# EAGLE design BRD1001-001-004-320 - Register (EAGLE 9.4.2)
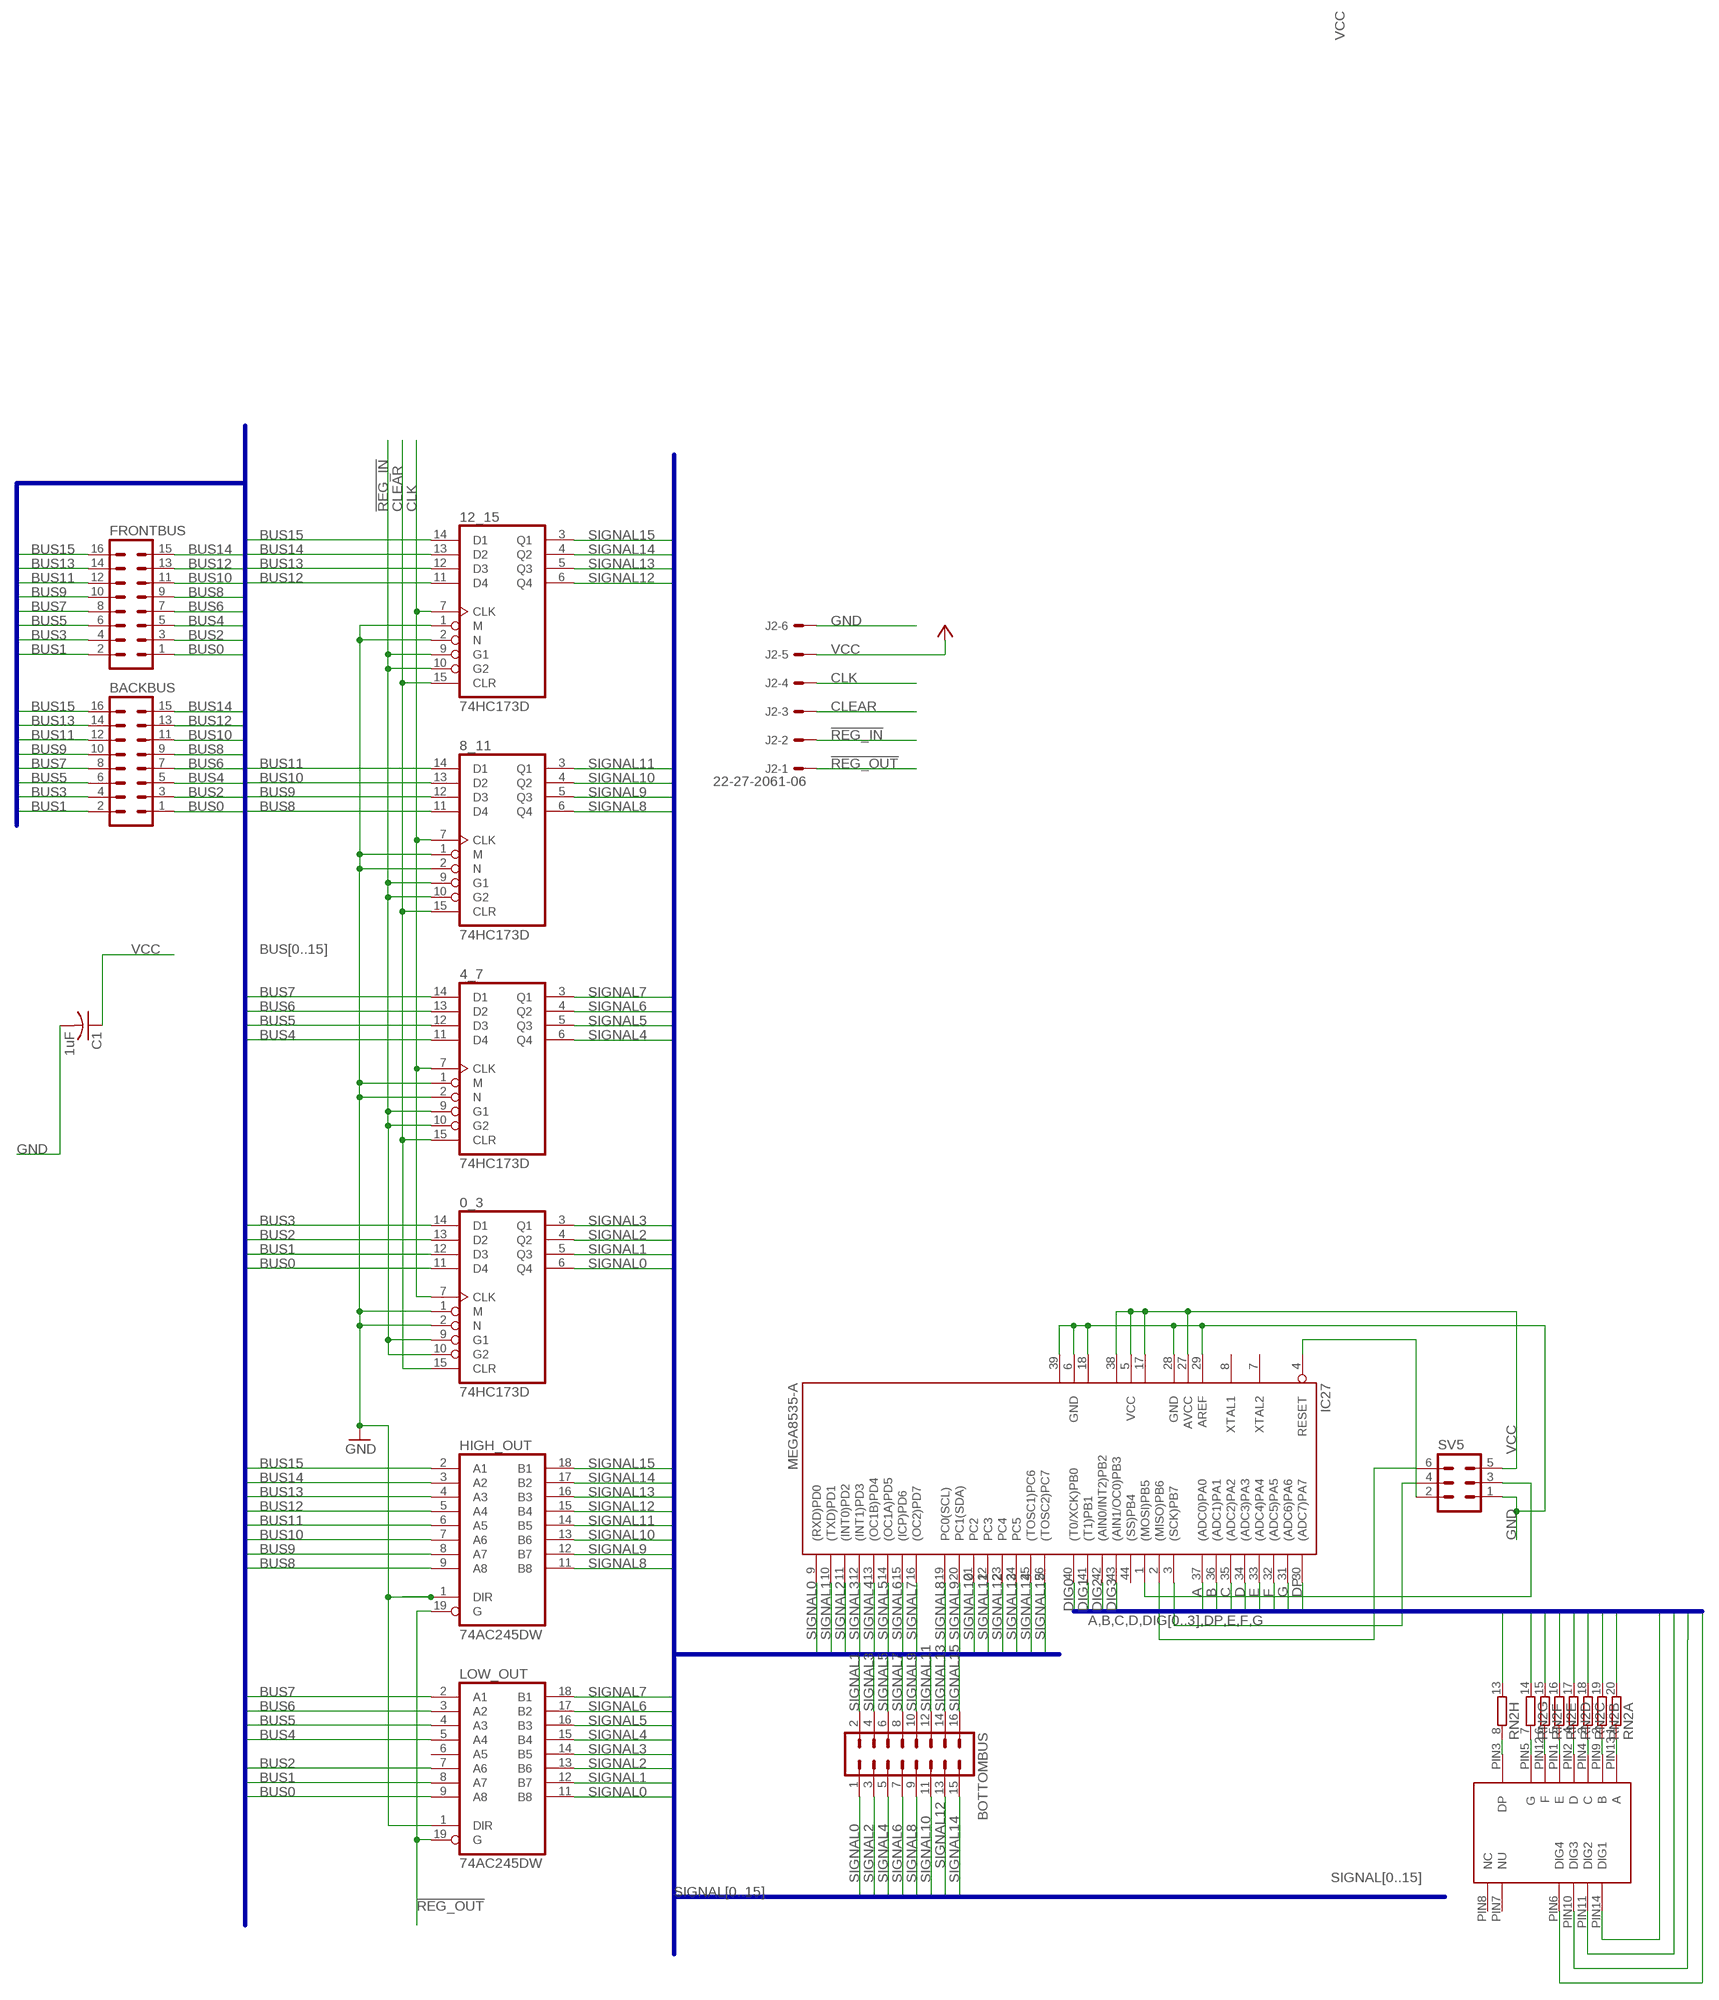
[diagram p0: schematic, sheet 1]

## Parts
0_3  74HC173D  [SO16]
4_7  74HC173D  [SO16]
8_11  74HC173D  [SO16]
12_15  74HC173D  [SO16]
BACKBUS  ML16  [ML16]
BOTTOMBUS  ML16  [ML16]
C1  1uF  C-USC1206  [C1206]
FRONTBUS  ML16  [ML16]
HIGH_OUT  74AC245DW  [SO20W]
IC27  MEGA8535-A  [TQFP44]
J2  22-27-2061-06  [6410-06]
LOW_OUT  74AC245DW  [SO20W]
RN2  10R-NSOMC  [SOMC20]
SV5  ML6  [ML6]
U$1  4-DIGIT-7-SEGMENT  [4-DIGIT-7-SEGMENT]

## Nets
!REG_IN: 0_3.9(G1) 0_3.10(G2) 4_7.9(G1) 4_7.10(G2) 8_11.9(G1) 8_11.10(G2) 12_15.9(G1) 12_15.10(G2) J2.2
!REG_OUT: HIGH_OUT.19(G) J2.1 LOW_OUT.19(G)
A: IC27.37((ADC0)PA0) RN2.20
B: IC27.36((ADC1)PA1) RN2.19
BUS0: 0_3.11(D4) BACKBUS.1 FRONTBUS.1 LOW_OUT.9(A8)
BUS1: 0_3.12(D3) BACKBUS.2 FRONTBUS.2 LOW_OUT.8(A7)
BUS2: 0_3.13(D2) BACKBUS.3 FRONTBUS.3 LOW_OUT.7(A6)
BUS3: 0_3.14(D1) BACKBUS.4 FRONTBUS.4
BUS4: 4_7.11(D4) BACKBUS.5 FRONTBUS.5 LOW_OUT.5(A4)
BUS5: 4_7.12(D3) BACKBUS.6 FRONTBUS.6 LOW_OUT.4(A3)
BUS6: 4_7.13(D2) BACKBUS.7 FRONTBUS.7 LOW_OUT.3(A2)
BUS7: 4_7.14(D1) BACKBUS.8 FRONTBUS.8 LOW_OUT.2(A1)
BUS8: 8_11.11(D4) BACKBUS.9 FRONTBUS.9 HIGH_OUT.9(A8)
BUS9: 8_11.12(D3) BACKBUS.10 FRONTBUS.10 HIGH_OUT.8(A7)
BUS10: 8_11.13(D2) BACKBUS.11 FRONTBUS.11 HIGH_OUT.7(A6)
BUS11: 8_11.14(D1) BACKBUS.12 FRONTBUS.12 HIGH_OUT.6(A5)
BUS12: 12_15.11(D4) BACKBUS.13 FRONTBUS.13 HIGH_OUT.5(A4)
BUS13: 12_15.12(D3) BACKBUS.14 FRONTBUS.14 HIGH_OUT.4(A3)
BUS14: 12_15.13(D2) BACKBUS.15 FRONTBUS.15 HIGH_OUT.3(A2)
BUS15: 12_15.14(D1) BACKBUS.16 FRONTBUS.16 HIGH_OUT.2(A1)
C: IC27.35((ADC2)PA2) RN2.18
CLEAR: 0_3.15(CLR) 4_7.15(CLR) 8_11.15(CLR) 12_15.15(CLR) J2.3
CLK: 0_3.7(CLK) 4_7.7(CLK) 8_11.7(CLK) 12_15.7(CLK) J2.4
D: IC27.34((ADC3)PA3) RN2.17
DIG0: IC27.40((T0/XCK)PB0) U$1.PIN14(DIG1)
DIG1: IC27.41((T1)PB1) U$1.PIN11(DIG2)
DIG2: IC27.42((AIN0/INT2)PB2) U$1.PIN10(DIG3)
DIG3: IC27.43((AIN1/OC0)PB3) U$1.PIN6(DIG4)
DP: IC27.30((ADC7)PA7) RN2.13
E: IC27.33((ADC4)PA4) RN2.16
F: IC27.32((ADC5)PA5) RN2.15
G: IC27.31((ADC6)PA6) RN2.14
GND [power]: 0_3.1(M) 0_3.2(N) 4_7.1(M) 4_7.2(N) 8_11.1(M) 8_11.2(N) 12_15.1(M) 12_15.2(N) C1.2 HIGH_OUT.1(DIR) IC27.6(GND) IC27.18(GND1) IC27.28(GND) IC27.29(AREF) IC27.39(GND2) J2.6 LOW_OUT.1(DIR) SV5.1
N$18: IC27.1((MOSI)PB5) SV5.3
N$19: IC27.3((SCK)PB7) SV5.4
N$20: IC27.2((MISO)PB6) SV5.6
N$21: IC27.4(RESET) SV5.2
N$24: RN2.1 U$1.PIN13(A)
N$25: RN2.2 U$1.PIN9(B)
N$26: RN2.3 U$1.PIN4(C)
N$27: RN2.4 U$1.PIN2(D)
N$28: RN2.5 U$1.PIN1(E)
N$29: RN2.6 U$1.PIN12(F)
N$30: RN2.7 U$1.PIN5(G)
N$31: RN2.8 U$1.PIN3(DP)
SIGNAL0: 0_3.6(Q4) BOTTOMBUS.1 IC27.9((RXD)PD0) LOW_OUT.11(B8)
SIGNAL1: 0_3.5(Q3) BOTTOMBUS.2 IC27.10((TXD)PD1) LOW_OUT.12(B7)
SIGNAL2: 0_3.4(Q2) BOTTOMBUS.3 IC27.11((INT0)PD2) LOW_OUT.13(B6)
SIGNAL3: 0_3.3(Q1) BOTTOMBUS.4 IC27.12((INT1)PD3) LOW_OUT.14(B5)
SIGNAL4: 4_7.6(Q4) BOTTOMBUS.5 IC27.13((OC1B)PD4) LOW_OUT.15(B4)
SIGNAL5: 4_7.5(Q3) BOTTOMBUS.6 IC27.14((OC1A)PD5) LOW_OUT.16(B3)
SIGNAL6: 4_7.4(Q2) BOTTOMBUS.7 IC27.15((ICP)PD6) LOW_OUT.17(B2)
SIGNAL7: 4_7.3(Q1) BOTTOMBUS.8 IC27.16((OC2)PD7) LOW_OUT.18(B1)
SIGNAL8: 8_11.6(Q4) BOTTOMBUS.9 HIGH_OUT.11(B8) IC27.19(PC0(SCL))
SIGNAL9: 8_11.5(Q3) BOTTOMBUS.10 HIGH_OUT.12(B7) IC27.20(PC1(SDA))
SIGNAL10: 8_11.4(Q2) BOTTOMBUS.11 HIGH_OUT.13(B6) IC27.21(PC2)
SIGNAL11: 8_11.3(Q1) BOTTOMBUS.12 HIGH_OUT.14(B5) IC27.22(PC3)
SIGNAL12: 12_15.6(Q4) BOTTOMBUS.13 HIGH_OUT.15(B4) IC27.23(PC4)
SIGNAL13: 12_15.5(Q3) BOTTOMBUS.14 HIGH_OUT.16(B3) IC27.24(PC5)
SIGNAL14: 12_15.4(Q2) BOTTOMBUS.15 HIGH_OUT.17(B2) IC27.25((TOSC1)PC6)
SIGNAL15: 12_15.3(Q1) BOTTOMBUS.16 HIGH_OUT.18(B1) IC27.26((TOSC2)PC7)
VCC [power]: C1.1 IC27.5(VCC) IC27.17(VCC1) IC27.27(AVCC) IC27.38(VCC2) J2.5 SV5.5
Unconnected: IC27.7(XTAL2) IC27.8(XTAL1) IC27.44((SS)PB4) LOW_OUT.6(A5) RN2.9 RN2.10 RN2.11 RN2.12 U$1.PIN7(NU) U$1.PIN8(NC)

## Buses
BUS[0..15]
SIGNAL[0..15]
A,B,C,D,DIG[0..3],DP,E,F,G

## Power pins joined to a net without a drawn wire
GND: 0_3.8(GND) 4_7.8(GND) 8_11.8(GND) 12_15.8(GND) HIGH_OUT.10(GND) LOW_OUT.10(GND)
VCC: 0_3.16(VCC) 4_7.16(VCC) 8_11.16(VCC) 12_15.16(VCC) HIGH_OUT.20(VCC) LOW_OUT.20(VCC)

## Library data of the parts
0_3 4_7 8_11 12_15 = 74xx-eu:74*173: 4-bit D type REGISTER, 3-state
BACKBUS BOTTOMBUS FRONTBUS = con-harting-ml:ML16: HARTING; OC_FARNELL: unknown; OC_NEWARK: unknown
C1 = rcl:C-US: CAPACITOR, American symbol; SPICEPREFIX: C
HIGH_OUT LOW_OUT = 74xx-eu:74*245: Octal BUS TRANSCEIVER, 3-state
IC27 = atmel:MEGA8535: MICROCONTROLLER 8 Kbytes FLASH 512 bytes SRAM 512 bytes EEPROM USART 8-channel 10 bit ADC Source: avr.lbr; MPN: ATMEGA8535-16AU; OC_FARNELL: 1528437; OC_NEWARK: 01M6908
J2 = con-molex:22-?-06: CONNECTOR wire to board 2.54 mm (.1 inch) pitch header; MF: MOLEX; OC_FARNELL: unknown; OC_NEWARK: unknown
RN2 = resistor-dil:10R-N: DIL RESISTOR; OC_FARNELL: unknown; OC_NEWARK: unknown
SV5 = con-harting-ml:ML6: HARTING; OC_FARNELL: unknown; OC_NEWARK: unknown
U$1 = ADAFRUIT:4-DIGIT-7-SEGMENT

## Net classes
2 power: width 0.457 mm

## Board
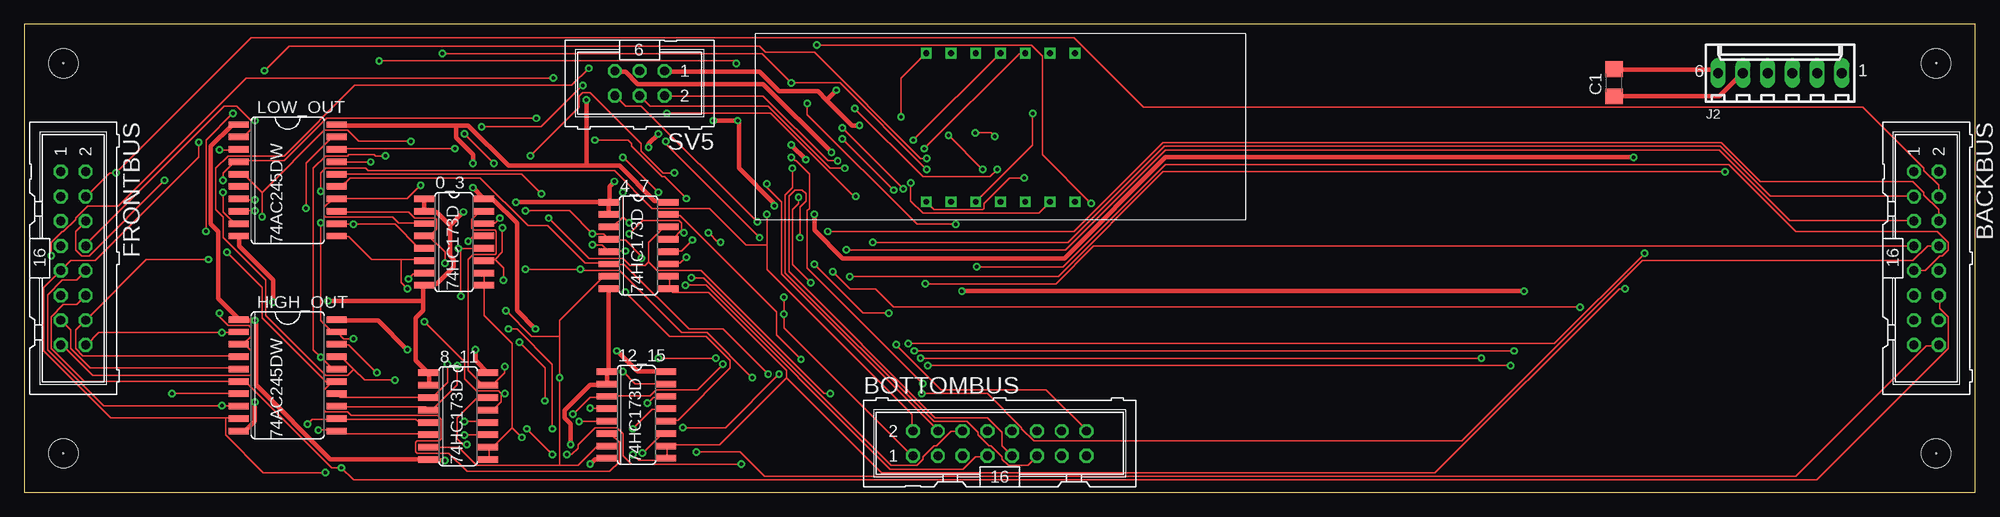
[diagram p1: board, top side]
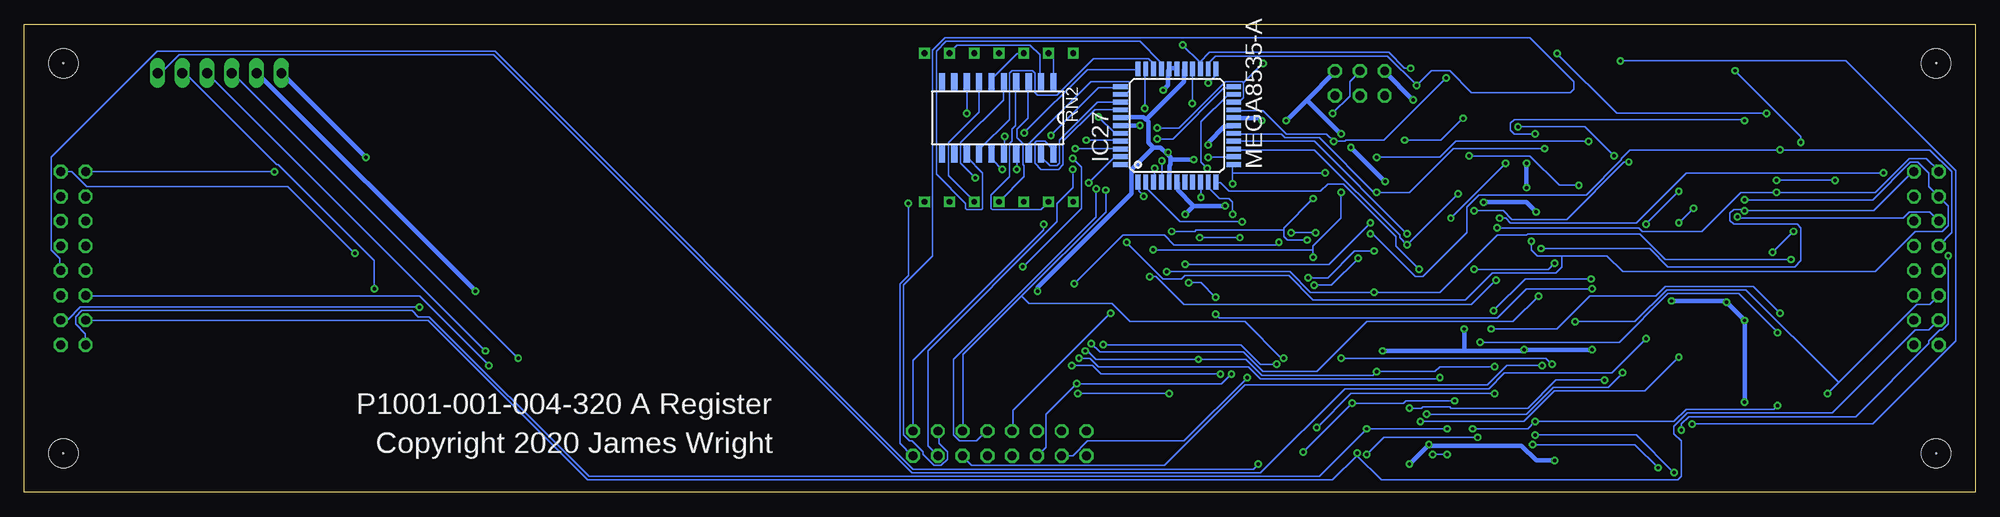
[diagram p2: board, bottom side, seen from below]

Size 200 x 48 mm. Coordinates in mm from the lower left corner, seen from the top.
Outline: 0,0 200,0 200,48 0,48 0,0
Copper layers (1*16): Top 0.035mm / dielectric 1.5mm / Bottom 0.035mm
Design rules "default *": minimum track width 6mil, minimum drill 0.35mm, track to track 6mil, track to pad 6mil, pad to pad 6mil, via to via 6mil, smd to smd 6mil, copper to edge 40mil, drill to drill 6mil, minimum pad ring 10mil, minimum via ring 8mil, stop-mask expansion 4mil, vias tented up to drill 0mil, thermal gap 10mil
Holes 0.12 mm at 4,4 196,44 4,44 196,4
Holes 3 mm at 4,44 4,4 196,4 196,44

### Footprints (pad centres in the part's own frame; a part is rotated, then mirrored left to right if it is on the bottom)
SO16 = smd 0.66 x 2.032: 1 -4.445,-3.073; 2 -3.175,-3.073; 3 -1.905,-3.073; 4 -0.635,-3.073; 5 0.635,-3.073; 6 1.905,-3.073; 7 3.175,-3.073; 8 4.445,-3.073; 9 4.445,3.073; 10 3.175,3.073; 11 1.905,3.073; 12 0.635,3.073; 13 -0.635,3.073; 14 -1.905,3.073; 15 -3.175,3.073; 16 -4.445,3.073
ML16 = drill 0.914 octagon: 1 -8.89,-1.27; 2 -8.89,1.27; 3 -6.35,-1.27; 4 -6.35,1.27; 5 -3.81,-1.27; 6 -3.81,1.27; 7 -1.27,-1.27; 8 -1.27,1.27; 9 1.27,-1.27; 10 1.27,1.27; 11 3.81,-1.27; 12 3.81,1.27; 13 6.35,-1.27; 14 6.35,1.27; 15 8.89,-1.27; 16 8.89,1.27
C1206 = smd 1.6 x 1.8: 1 -1.4,0; 2 1.4,0
SO20W = smd 0.66 x 2.032: 1 -5.715,-5.029; 2 -4.445,-5.029; 3 -3.175,-5.029; 4 -1.905,-5.029; 5 -0.635,-5.029; 6 0.635,-5.029; 7 1.905,-5.029; 8 3.175,-5.029; 9 4.445,-5.029; 10 5.715,-5.029; 11 5.715,5.029; 12 4.445,5.029; 13 3.175,5.029; 14 1.905,5.029; 15 0.635,5.029; 16 -0.635,5.029; 17 -1.905,5.029; 18 -3.175,5.029; 19 -4.445,5.029; 20 -5.715,5.029
TQFP44 = smd 1.5 x 0.5: 1 -5.8,4; 2 -5.8,3.2; 3 -5.8,2.4; 4 -5.8,1.6; 5 -5.8,0.8; 6 -5.8,0; 7 -5.8,-0.8; 8 -5.8,-1.6; 9 -5.8,-2.4; 10 -5.8,-3.2; 11 -5.8,-4; 23 5.8,-4; 24 5.8,-3.2; 25 5.8,-2.4; 26 5.8,-1.6; 27 5.8,-0.8; 28 5.8,0; 29 5.8,0.8; 30 5.8,1.6; 31 5.8,2.4; 32 5.8,3.2; 33 5.8,4 | smd 0.5 x 1.5: 12 -4,-5.8; 13 -3.2,-5.8; 14 -2.4,-5.8; 15 -1.6,-5.8; 16 -0.8,-5.8; 17 0,-5.8; 18 0.8,-5.8; 19 1.6,-5.8; 20 2.4,-5.8; 21 3.2,-5.8; 22 4,-5.8; 34 4,5.8; 35 3.2,5.8; 36 2.4,5.8; 37 1.6,5.8; 38 0.8,5.8; 39 0,5.8; 40 -0.8,5.8; 41 -1.6,5.8; 42 -2.4,5.8; 43 -3.2,5.8; 44 -4,5.8
6410-06 = drill 1.016 long: 1 6.35,0; 2 3.81,0; 3 1.27,0; 4 -1.27,0; 5 -3.81,0; 6 -6.35,0
SOMC20 = smd 1.91 x 0.64: 1 -3.62,5.715; 2 -3.62,4.445; 3 -3.62,3.175; 4 -3.62,1.905; 5 -3.62,0.635; 6 -3.62,-0.635; 7 -3.62,-1.905; 8 -3.62,-3.175; 9 -3.62,-4.445; 10 -3.62,-5.715; 11 3.62,-5.715; 12 3.62,-4.445; 13 3.62,-3.175; 14 3.62,-1.905; 15 3.62,-0.635; 16 3.62,0.635; 17 3.62,1.905; 18 3.62,3.175; 19 3.62,4.445; 20 3.62,5.715
ML6 = drill 0.914 octagon: 1 -2.54,-1.27; 2 -2.54,1.27; 3 0,-1.27; 4 0,1.27; 5 2.54,-1.27; 6 2.54,1.27
4-DIGIT-7-SEGMENT = drill 0.6 square: PIN1 17.48,1.88; PIN2 20.02,1.88; PIN3 22.56,1.88; PIN4 25.1,1.88; PIN5 27.64,1.88; PIN6 30.18,1.88; PIN7 32.72,1.88; PIN8 32.72,17.12; PIN9 30.18,17.12; PIN10 27.64,17.12; PIN11 25.1,17.12; PIN12 22.56,17.12; PIN13 20.02,17.12; PIN14 17.48,17.12

### Placement (x,y rotation side)
0_3  44.05,25.66 270 top
4_7  62.96,25.32 270 top
8_11  44.47,7.8 270 top
12_15  62.75,7.93 270 top
BACKBUS  195,24 270 top
BOTTOMBUS  100,5 0 top
C1  163,42 90 top
FRONTBUS  5,24 270 top
HIGH_OUT  27,12 270 top
IC27  81.83,37.62 90 bottom
J2  180,43 0 top
LOW_OUT  27,32 270 top
RN2  100.21,38.41 270 bottom
SV5  63.08,41.95 180 top
U$1  74.98,27.92 0 top

### Tracks (layer width: path | path; a pad name or v marks a point on that pad's centre or on a via)
!REG_IN  (via drill 0.35)
  Top 0.152: 47.62,4.62 47.62,3.38 8_11.9 | 0_3.10 47.12,22.38 47.12,21.25 0_3.9 47.12,21.12 47.12,18.12 50,15.25 50,6.62 | 47.62,4.62 48,4.62 50,6.62 | 47.62,4.62 8_11.10 | 66.12,20.88 66.12,22.12 4_7.10 | 78.12,11.75 71.25,4.88 65.88,4.88 12_15.10 65.88,4.75 65.88,3.5 12_15.9 65.75,3.38 65.62,3.25 63,3.25 v62.38,3.88 | 78.12,11.75 78.12,12.5 70.12,20.5 66.5,20.5 66.12,20.88 | 66.12,20.88 4_7.9 | v164.12,20.88 163.5,20.88 144.62,2 87.88,2 78.12,11.75 | v51,5.62 50,6.62
  Bottom 0.152: J2.2 183.5,43 174.12,33.62 174,33.62 164.12,23.75 v164.12,20.88 | v51,5.62 60.62,5.62 v62.38,3.88
!REG_OUT  (via drill 0.35)
  Top 0.152: v30.38,27.62 30.38,17.62 31.5,16.5 32,16.5 HIGH_OUT.19 32.12,16.38 32.75,15.75 v33.75,15.75 | v28.88,29.12 28.88,33.75 31.5,36.38 32,36.38 LOW_OUT.19
  Bottom 0.152: v28.88,29.12 v30.38,27.62 | J2.1 186,43 184.12,44.88 151.88,44.88 109,2 73.25,2 64.62,10.62 49.88,10.62 48.25,12.25 37.25,12.25 v33.75,15.75
A
  Bottom 0.152: IC27.37 87.75,39.25 90.25,39.25 93.5,36 93.5,33.62 94,33.12 95.75,33.12 96.38,33.75 96.38,35.88 96.25,36 95.38,36 94.5,35.12 94.5,34.88 RN2.20
B
  Bottom 0.152: IC27.36 87.75,40 90,40 93.88,36.12 93.88,33.75 94.12,33.5 94.88,33.5 95.75,34.38 95.75,34.75 RN2.19
BUS0  (via drill 0.35)
  Top 0.152: v20.38,30.75 20.38,28.75 21.5,27.62 21.88,27.62 LOW_OUT.9 | 48.25,23.88 47.12,23.88 0_3.11 | 48.25,23.88 49,24.62 v49,27.12 | v174.38,32.88 116.75,32.88 106,22.12 v84.62,22.12 | v49.12,21.75 49.12,23 48.25,23.88
  Bottom 0.152: FRONTBUS.1 3.75,33 5,34.25 6.75,34.25 10.25,30.75 v20.38,30.75 24,30.75 28,26.75 34.12,26.75 34.5,27.12 v49,27.12 | v174.38,32.88 193.62,32.88 BACKBUS.1 | v84.62,22.12 84,22.12 81.12,19.25 51.62,19.25 v49.12,21.75
BUS1  (via drill 0.35)
  Top 0.152: v23.62,28.88 22,28.88 LOW_OUT.8 | 44.75,25 47,25 0_3.12 | v166.12,24.5 156.88,15.25 v90.62,15.25 | 44.75,25 v44.75,20.12 | 44.75,25 v44.5,25
  Bottom 0.152: FRONTBUS.2 6.38,32.88 10.38,28.88 v23.62,28.88 23.75,29 24.75,29 25.12,28.62 25.12,27.88 24.75,27.5 18.25,27.5 17.88,27.12 17.88,23.75 18.5,23.12 31.5,23.12 33.38,25 v44.5,25 | v166.12,24.5 173,31.38 193.62,31.38 195.12,32.88 196.25,32.88 BACKBUS.2 | v90.62,15.25 89.75,14.38 75,14.38 73,12.38 67.5,12.38 62.38,17.5 47.38,17.5 v44.75,20.12
BUS2  (via drill 0.35)
  Top 0.152: v23.62,30 22,30 LOW_OUT.7 | v45.5,25.75 46,26.25 47,26.25 0_3.13 | v87,25.62 107,25.62 116.88,35.5 173.88,35.5 179,30.38 193.62,30.38 BACKBUS.3
  Bottom 0.152: v23.62,30 10.5,30 6.62,33.88 5.88,33.88 4.75,32.75 4.75,31.38 3.75,30.38 FRONTBUS.3 3.62,30.25 2.75,29.38 2.75,27.38 3.38,26.75 6.12,26.75 10.25,22.62 36.12,22.62 37.75,24.25 42.38,24.25 | v45.5,25.75 45.5,24.88 44.88,24.25 42.38,24.25 | v87,25.62 83.25,21.88 81.38,21.88 81,22.25 70.38,22.25 67.88,19.75 52.25,19.75 49.5,22.5 43,22.5 42.38,23.12 42.38,24.25
BUS3  (via drill 0.35)
  Top 0.152: v48.75,28.12 48.25,27.62 47.12,27.62 0_3.14 | FRONTBUS.4 6.38,30.38 8.75,32.75 v9.38,32.75 23.25,46.62 107.62,46.62 114.75,39.5 188.5,39.5 194.75,33.25 194.75,33 196.25,31.5 196.25,30.38 BACKBUS.4
  Bottom 0.152: v48.75,28.12 48.12,28.12 47.62,27.62 34.75,27.62 29.62,32.75 v9.38,32.75
BUS4  (via drill 0.35)
  Top 0.152: 24.38,30.75 22.5,32.62 22,32.62 LOW_OUT.5 | v24.38,28.25 24.38,30.75 | v67.88,24.12 67.25,23.5 66.12,23.5 4_7.11 | v61.38,34.38 v65,30.75 | v39.62,36 34.25,36 33.12,37.12 30.75,37.12 24.38,30.75 | v84.25,24.88 106.75,24.88 117,35.12 173.75,35.12 181,27.88 193.62,27.88 BACKBUS.5
  Bottom 0.152: v24.38,28.25 24.12,28.25 24,28.12 7.38,28.12 6.75,28.75 4.62,28.75 3.75,27.88 FRONTBUS.5 | 67.88,24.88 67.88,25.25 65,28.12 v65,30.75 | 67.88,24.88 v67.88,24.12 | v61.38,34.38 54.88,34.38 53.25,36 v39.62,36 | 67.88,24.88 v84.25,24.88
BUS5  (via drill 0.35)
  Top 0.152: v20.38,32 20.38,32.75 21.5,33.88 21.88,33.88 LOW_OUT.4 22,34 26.62,34 31,38.38 v52.5,38.38 | v14.38,32 6.62,24.25 5.88,24.25 5.25,24.88 5.25,26.75 6.25,27.75 FRONTBUS.6 | v68.5,25.88 67.38,24.75 66.12,24.75 4_7.12 | v67.88,30.12 65.62,32.38 65.38,32.38 62.25,35.5 62.25,35.75 61.88,36.12 v58.5,36.12 | v82.38,26.75 107.62,26.75 116.75,35.88 174,35.88 178,31.88 193.62,31.88 194.75,30.75 194.75,30.5 196.25,29 196.25,27.88 BACKBUS.6
  Bottom 0.152: v14.38,32 v20.38,32 | v68.5,25.88 70.5,25.88 70.88,26.25 70.88,26.88 | 70.88,26.88 70.88,27.12 v67.88,30.12 | v58.5,36.12 54.75,36.12 v52.5,38.38 | v82.38,26.75 80,26.75 79.88,26.88 70.88,26.88
BUS6  (via drill 0.35)
  Top 0.152: v20,35.12 21.88,35.12 LOW_OUT.3 | 67.38,26.88 66.5,26 66.12,26 4_7.13 | 67.38,26.88 67.38,27.62 67.12,27.88 63.38,27.88 v62,26.5 | v92.38,21.38 105.75,21.38 109.62,25.25 193.62,25.25 BACKBUS.7 | v71.38,25.62 71.12,25.62 v70.12,26.62 | 67.38,26.88 v67.62,26.62
  Bottom 0.152: FRONTBUS.7 2.38,26.62 2.38,32.88 4.62,35.12 v20,35.12 35.38,35.12 36.25,34.25 36.25,34.12 39.88,30.5 50.88,30.5 52.12,29.25 52.12,26.62 56.62,22.12 57.38,22.12 61.75,26.5 v62,26.5 | v92.38,21.38 87.38,26.38 83.12,26.38 82.12,25.38 71.62,25.38 v71.38,25.62 | v67.62,26.62 v70.12,26.62
BUS7  (via drill 0.35)
  Top 0.152: 23.25,38.12 23.25,37.25 22.5,36.5 22,36.5 LOW_OUT.2 | 23.25,38.12 21.75,39.62 20.5,39.62 6.25,25.38 FRONTBUS.8 | 64,23.62 64,25.62 65.5,27.12 66,27.12 4_7.14 | 64,23.62 63.62,23.25 62.12,23.25 61.38,24 57.88,24 v53.75,28.12 | v45.12,36.75 v48.12,33.75 | 23.25,38.12 v23.62,38.12 | v92,10.12 98.75,10.12 102.25,6.62 102.25,6.5 103.5,5.25 147.38,5.25 165.88,23.75 193.62,23.75 195.12,25.25 196.25,25.25 BACKBUS.8 | v82.62,10.12 82,10.12 69.38,22.75 64.88,22.75 64,23.62
  Bottom 0.152: v48.12,33.75 v53.75,28.12 | v45.12,36.75 47.25,36.75 47.62,37.12 47.62,37.88 47.25,38.25 23.75,38.25 v23.62,38.12 | v82.62,10.12 v92,10.12
BUS8  (via drill 0.35)
  Top 0.152: 20.62,7.62 8.88,7.62 2,14.5 2,21 FRONTBUS.9 4.75,23.75 7.25,23.75 17.88,34.38 v17.88,35.88 | 20.62,7.62 21.88,7.62 HIGH_OUT.9 | v45.12,5.88 47.5,5.88 8_11.11 | v30.88,2 24.5,2 20.62,5.88 20.62,7.62 | v97.62,23.12 106.5,23.12 117,33.62 174.75,33.62 181.62,26.75 196.12,26.75 197.25,25.62 197.25,24.88 196.62,24.25 196.38,24.25 194.88,22.75 193.75,22.75 BACKBUS.9 | v92.5,34.25 91.88,34.25 81,45.12 76,45.12 75.38,45.75 27.12,45.75 v24.62,43.25
  Bottom 0.152: v45.12,5.88 34.75,5.88 v30.88,2 | v97.62,23.12 91.62,29.12 91.62,33.38 v92.5,34.25 | v24.62,43.25 17.88,36.5 v17.88,35.88
BUS9  (via drill 0.35)
  Top 0.152: HIGH_OUT.8 21.88,8.88 v20.25,8.88 8.12,8.88 2.38,14.62 2.38,20.25 3.88,21.75 5.38,21.75 6.25,22.62 FRONTBUS.10 | v45.12,7.25 47.5,7.25 8_11.12 | v73.5,2.88 62.25,2.88 61.38,3.75 61.38,6 60.75,6.62 58.5,6.62 56.75,4.88 56.75,4.5 56.12,3.88 v55.62,3.88 | v51.5,6.5 v54.12,3.88
  Bottom 0.152: v20.25,8.88 20.62,8.5 29.62,8.5 30.88,7.25 v45.12,7.25 45.88,6.5 v51.5,6.5 | v73.5,2.88 74,2.38 108.88,2.38 151.75,45.25 186.38,45.25 197.25,34.38 197.25,24.88 196.38,24 196.38,22.75 BACKBUS.10 | v54.12,3.88 v55.62,3.88
BUS10  (via drill 0.35)
  Top 0.152: v15.12,10.12 21.88,10.12 HIGH_OUT.7 | 48.88,10.12 48.88,9.25 48.12,8.5 47.62,8.5 8_11.13 | 48.88,10.12 48.62,10.38 46.38,10.38 45.12,11.62 45.12,13.38 v41,17.5 | v92.62,13 v152.38,13 | v77.38,12.12 71.88,6.62 v67.5,6.62 | 48.88,10.12 v49.25,10.12
  Bottom 0.152: 14,11.25 6,19.25 4.62,19.25 3.75,20.12 FRONTBUS.11 | 14,11.25 v15.12,10.12 | v41,17.5 34.88,17.5 31.62,20.75 23.5,20.75 14,11.25 | v152.38,13 159.5,20.12 193.62,20.12 BACKBUS.11 | v92.62,13 90.5,13 89.62,12.12 v77.38,12.12 | v67.5,6.62 64,10.12 v49.25,10.12
BUS11  (via drill 0.35)
  Top 0.152: FRONTBUS.12 6.25,20.12 5.38,19.25 4,19.25 2.75,18 2.75,14.75 6.12,11.38 21.88,11.38 HIGH_OUT.6 22,11.25 22.75,11.25 31.5,2.5 v32.5,2.5 33.75,1.25 183.75,1.25 197.25,14.75 197.25,18 196.38,18.88 196.38,20.12 BACKBUS.12 | v45.38,4.88 45,4.88 44.38,5.5 44.38,7.62 46.38,9.62 47.5,9.62 8_11.14
  Bottom 0.152: v45.38,4.88 34.88,4.88 v32.5,2.5
BUS12  (via drill 0.35)
  Top 0.152: v63.38,4 65.38,6 65.75,6 12_15.11 | HIGH_OUT.5 21.88,12.75 6.75,12.75 4.75,14.75 4.75,16.62 3.75,17.62 FRONTBUS.13
  Bottom 0.152: 63.38,3.75 60.88,1.25 30.5,1.25 30.12,1.62 30.12,5.25 30.88,6 30.88,6.75 29.5,8.12 14.62,8.12 6.12,16.62 4.75,16.62 3.75,17.62 FRONTBUS.13 | 63.38,3.75 65.88,1.25 142.25,1.25 158.62,17.62 193.62,17.62 BACKBUS.13 | 63.38,3.75 v63.38,4
BUS13  (via drill 0.35)
  Top 0.152: v61.62,20.5 66.12,16 69.88,16 72.38,13.5 72.38,12.75 67,7.38 65.88,7.38 12_15.12 | v18.88,23.88 12.5,23.88 6.38,17.75 FRONTBUS.14 6.25,17.62 5.25,16.62 5.25,14.75 6,14 21.88,14 HIGH_OUT.4 | v159.5,19 89.12,19 87.25,20.88 84.62,20.88 v82.88,22.62
  Bottom 0.152: v18.88,23.88 31.75,23.88 34.38,26.5 45.88,26.5 46,26.38 49,26.38 54.88,20.5 v61.62,20.5 68.12,20.5 70.25,22.62 v82.88,22.62 | v159.5,19 194.25,19 195.5,17.75 196.25,17.75 BACKBUS.14
BUS14  (via drill 0.35)
  Top 0.152: v62.38,6.5 64.38,8.5 65.75,8.5 12_15.13 | v54.12,6.5 54.12,13.12 50.5,16.75 v49.62,16.75 | v20,18.38 20,18 20.88,17.12 23,17.12 23.25,16.88 23.25,16 22.5,15.25 | 22.5,15.25 22,15.25 HIGH_OUT.3 22.5,15.25 | 22.5,15.25 23.25,14.5 23.25,12.12 23.12,12 7,12 4,15 3.75,15 FRONTBUS.15
  Bottom 0.152: v54.12,6.5 v62.38,6.5 67.25,1.62 142.12,1.62 158.5,18 159.62,18 160.25,18.62 194.12,18.62 194.75,18 194.75,17.25 193.75,16.25 193.75,15.12 BACKBUS.15 | v49.62,16.75 42.88,16.75 39.5,20.12 32.75,20.12 31.75,21.12 22.75,21.12 v20,18.38
BUS15  (via drill 0.35)
  Top 0.152: HIGH_OUT.2 21.88,16.38 v20.25,16.38 7.62,16.38 6.38,15.12 FRONTBUS.16 | v63.88,9.12 64.5,9.75 65.75,9.75 12_15.14 | v53.38,9.38 53.38,12.75 v50.75,15.38 | v68.88,4.12 73.38,4.12 75.88,1.62 181.62,1.62 195,15 196.25,15 BACKBUS.16
  Bottom 0.152: v53.38,9.38 58.38,9.38 58.62,9.12 v63.88,9.12 v68.88,4.12 | v50.75,15.38 36.5,15.38 31.5,20.38 24.25,20.38 v20.25,16.38
C
  Bottom 0.152: IC27.35 87.62,40.88 87,40.88 86.62,41.25 86.62,42 86.75,42.12 90.62,42.12 97,35.75 97,34.88 RN2.18
CLEAR  (via drill 0.35)
  Top 0.152: 0_3.15 47,28.75 46.62,28.75 45.88,28 45.88,27.12 46.12,26.88 48.25,26.88 48.38,26.75 48.38,24.5 48.25,24.38 46,24.38 45.5,23.88 45.5,12.5 47,11 47.5,11 8_11.15 47.62,11 48,11 49.25,12.25 v49.25,12.88 | v61.38,12.38 62.62,11.12 65.75,11.12 12_15.15 | v79.62,13.62 77.12,16.12 77.12,18.5 67.25,28.38 66.12,28.38 4_7.15 | v91.25,14.5 v152.75,14.5
  Bottom 0.152: v49.25,12.88 54.88,12.88 55.38,12.38 v61.38,12.38 61.75,12 73.12,12 74.75,13.62 v79.62,13.62 90.12,13.62 91,14.5 v91.25,14.5 | v152.75,14.5 181.25,43 J2.3
CLK  (via drill 0.35)
  Top 0.152: 8_11.7 44.5,4.62 46.38,2.75 54.88,2.75 | 54.88,2.75 56.75,2.75 58.75,4.75 59.62,4.75 12_15.7 | 54.88,2.75 v54.88,11.75 54.88,16 | 54.88,16 54.88,17.62 59.38,22.12 59.88,22.12 4_7.7 | v39.38,21.88 39.88,22.38 40.88,22.38 0_3.7 | v49.38,18.62 52,16 54.88,16 | v91.88,13.75 v149.38,13.75
  Bottom 0.152: v39.38,21.88 46.12,21.88 v49.38,18.62 | v149.38,13.75 178.62,43 J2.4 | v91.88,13.75 90.75,13.75 89.88,12.88 74.5,12.88 73.25,11.62 55,11.62 v54.88,11.75
D  (via drill 0.35)
  Top 0.152: v98.25,33.12 v94.75,36.62
  Bottom 0.152: v94.75,36.62 89.88,41.5 87.75,41.5 IC27.34 | v98.25,33.12 98.25,34.75 RN2.17
DIG0  (via drill 0.35)
  Top 0.152: v89.88,38.5 89.88,42.5 92.38,45 U$1.PIN14
  Bottom 0.152: v89.88,38.5 88.25,36.88 87.75,36.88 IC27.40
DIG1  (via drill 0.35)
  Top 0.152: v91.12,36.12 100,45 U$1.PIN11
  Bottom 0.152: v91.12,36.12 87.75,36.12 IC27.41
DIG2  (via drill 0.35)
  Top 0.152: v92.25,35.25 102,45 102.5,45 U$1.PIN10
  Bottom 0.152: v92.25,35.25 87.75,35.25 IC27.42
DIG3  (via drill 0.35)
  Top 0.152: v90.88,31.75 90.88,29.88 92.12,28.62 104,28.62 105.12,29.75 U$1.PIN6
  Bottom 0.152: v90.88,31.75 88.25,34.38 87.75,34.38 IC27.43
DP
  Bottom 0.152: IC27.30 83.5,43.5 83.5,44.12 85.62,46.25 105.5,46.25 106.5,45.25 106.5,32.62 103.5,29.62 103.5,29.12 103.38,29 101.88,29 101.75,29.12 101.75,32.75 103.38,34.38 103.38,34.75 RN2.13
E  (via drill 0.35)
  Top 0.152: v97.5,36.88 99.12,36.88 v99.5,36.5
  Bottom 0.152: v97.5,36.88 91,43.38 85.88,43.38 IC27.33 | v99.5,36.5 99.5,34.88 RN2.16
F  (via drill 0.35)
  Top 0.152: v85.12,39.38 92.12,32.38 99,32.38 v99.75,33.12
  Bottom 0.152: v85.12,39.38 85.12,43.38 IC27.32 | v99.75,33.12 100.75,34.12 100.75,34.75 RN2.15
G
  Bottom 0.152: IC27.31 84.25,43.5 84.25,44 84.75,44.5 90.38,44.5 94.12,40.75 96.12,40.75 96.38,41 96.38,43 96.62,43.25 98.75,43.25 99,43 99,38.25 102,35.25 102,34.88 RN2.14
GND  (via drill 0.35)
  Top 0.457: 4_7.2 59.88,28.5 59.88,29.75 4_7.1 | 0_3.1 41,30 41,28.88 0_3.2 41.12,28.75 42.25,28.75 43.62,27.38 | 8_11.2 41.5,11 41.5,12.12 8_11.1 41.25,12.38 40.12,13.5 40.12,17.88 40.88,18.62 40.88,19.62 | 40.88,19.62 40.88,21.12 0_3.8 41.12,21.38 42.25,21.38 44,23.12 44,23.88 43.62,24.25 43.62,27.38 | v50.38,29.75 59.75,29.75 4_7.1 | 43.62,27.38 v45,28.75 | v58,2.88 58.5,3.38 59.62,3.38 12_15.8 | v56,4.88 56,7 55.38,7.62 55.38,8.38 58,11 59.62,11 12_15.2 59.75,11.25 59.75,12.38 12_15.1 59.88,12.5 59.88,20.88 4_7.8 | v23.62,9.25 23.62,7.25 22.75,6.38 22,6.38 HIGH_OUT.10 | v25.5,19.5 25.5,21.75 22,25.25 22,26.25 LOW_OUT.10 | LOW_OUT.1 21.88,37.62 21.25,37.62 19.12,35.5 19.12,27.5 19.88,26.75 19.88,19.88 21.88,17.88 HIGH_OUT.1 22,17.62 v23.62,17.62 23.75,17.5 23.75,11 31.38,3.38 41.38,3.38 8_11.8 41.5,3.25 v43.12,3.25 | v31.12,19.62 40.88,19.62 | C1.2 163,43.38 173.25,43.38 173.62,43 J2.6 | v70.62,38.12 v73.12,38.12 73.25,38 73.25,33.25 76.88,29.62 v76.88,29.38 | v85.62,37.62 84.88,37.62 82.25,40.25 | 82.25,40.25 81.38,41.12 77.38,41.12 75.38,43.12 65.62,43.12 SV5.1 | 82.25,40.25 v83.25,41.25 | v165,34.38 117,34.38 106.62,24 83.88,24 81,26.88 v81,28.5 | v60.5,31.88 60,31.38 60,29.88 4_7.1 | v64,35.38 64,35.75 v65,36.75
  Bottom 0.457: v50.38,29.75 46,29.75 v45,28.75 | v58,2.88 v56,4.88 55.88,4.75 46.5,4.75 45,3.25 v43.12,3.25 | v23.62,9.25 v23.62,17.62 v25.5,19.5 25.62,19.62 v31.12,19.62 | IC27.28 81.88,43.5 82.62,43.5 IC27.29 82.75,43.25 82.75,41.75 v83.25,41.25 | v73.12,38.12 73.38,38.38 76,38.38 IC27.18 | 68.5,40.25 65.62,43.12 SV5.1 | 68.5,40.25 v70.62,38.12 | 80.12,29.38 81.75,31 81.75,31.75 IC27.6 | v76.88,29.38 80.12,29.38 | v85.62,37.62 IC27.39 | v165,34.38 173.62,43 J2.6 | 80.12,29.38 v81,28.5 | v64,35.38 v60.5,31.88 | 68.5,40.25 v65,36.75
N$18  (via drill 0.35)
  Top 0.152: v85.25,30.38 85,30.38 76.5,38.88 v65.88,38.88
  Bottom 0.152: v85.25,30.38 85.75,30.88 85.75,31.75 IC27.1 | v65.88,38.88 64.12,40.62 64.12,42.12 63.12,43.12 SV5.3
N$19  (via drill 0.35)
  Top 0.152: v84.12,33.25 82.62,33.25 76.25,39.62 64.12,39.62 63.12,40.62 SV5.4
  Bottom 0.152: v84.12,33.25 84.12,31.88 IC27.3
N$20  (via drill 0.35)
  Top 0.152: v75.12,27.75 63.25,39.62 61.62,39.62 60.62,40.62 SV5.6
  Bottom 0.152: v75.12,27.75 81.5,27.75 85,31.25 85,31.75 IC27.2
N$21  (via drill 0.35)
  Top 0.152: v83.38,34 82.38,34 75.75,40.62 65.62,40.62 SV5.2
  Bottom 0.152: v83.38,34 83.38,31.88 IC27.4
N$24
  Bottom 0.152: RN2.1 94.5,42.12 94.5,44.5 95,45 U$1.PIN13
N$25
  Bottom 0.152: RN2.2 95.88,42.12 95.88,44.88 96.88,45.88 104.38,45.88 105.12,45.12 U$1.PIN9
N$26
  Bottom 0.152: RN2.3 97.12,42 97.12,38.38 98.25,37.25 98.25,36.38 97.62,35.75 97.62,33.62 97.5,33.5 97.5,32.38 100,29.88 U$1.PIN4
N$27
  Bottom 0.152: RN2.4 98.38,42 98.38,37.62 98.75,37.25 98.75,36 99,35.75 99,32.38 100.88,30.5 100.88,29.12 100.75,29 95.75,29 95,29.75 U$1.PIN2
N$28  (via drill 0.35)
  Top 0.152: v102.5,32.25 101,32.25 98.38,29.62 98.38,29.12 98.25,29 93.25,29 92.5,29.75 U$1.PIN1
  Bottom 0.152: v102.5,32.25 104,33.75 104,35.88 99.62,40.25 99.62,42 RN2.5
N$29
  Bottom 0.152: RN2.6 100.75,42.12 100.75,42.5 98.25,45 97.62,45 U$1.PIN12
N$30
  Bottom 0.152: RN2.7 102.12,42 102.12,39 105.25,35.88 105.25,32.5 102.62,29.88 U$1.PIN5
N$31  (via drill 0.35)
  Top 0.152: v103.38,38.88 103.38,35.62 97.62,29.88 U$1.PIN3
  Bottom 0.152: v103.38,38.88 103.38,42 RN2.8
SIGNAL0  (via drill 0.35)
  Top 0.152: 38.62,23.88 40.88,23.88 0_3.6 | 38.62,23.88 35.62,23.88 33.25,26.25 32.12,26.25 LOW_OUT.11 | v79.38,30.25 79.38,29.62 78.75,29 78.75,23.38 v80.62,21.5 | v77.88,20 v77.88,18.25 77.88,16.88 91,3.75 BOTTOMBUS.1 | 38.62,23.88 38.62,21.5 v39.25,20.88
  Bottom 0.152: v79.38,30.25 79.38,31.75 IC27.9 | v80.62,21.5 79.38,21.5 v77.88,20 | v39.25,20.88 46,20.88 49,17.88 77.5,17.88 v77.88,18.25
SIGNAL1  (via drill 0.35)
  Top 0.152: LOW_OUT.12 32.12,27.5 v33.75,27.5 38,27.5 40.38,25.12 40.88,25.12 0_3.5 | 76.12,25.38 76.12,22.88 91,8 91,6.38 BOTTOMBUS.2 | 76.12,25.38 v76.12,28.5 | v30.38,30.88 30.38,32.75 30.88,33.25 35,33.25 35.25,33 60.5,33 64.38,29.12 70.25,29.12 74,25.38 76.12,25.38
  Bottom 0.152: v76.12,28.5 76.12,29.75 76.5,30.12 77.5,30.12 78.62,31.25 78.62,31.75 IC27.10 | v30.38,30.88 v33.75,27.5
SIGNAL2  (via drill 0.35)
  Top 0.152: v51.38,22.88 v57,22.88 57.12,22.75 61,22.75 67.38,16.38 70,16.38 v74.62,11.75 | v43.12,23.5 43.12,24.62 41.5,26.25 | 41.5,26.25 41,26.25 0_3.4 41.5,26.25 | 41.5,26.25 42.25,27 42.25,28 42.12,28.12 40,28.12 39.38,28.75 32.12,28.75 LOW_OUT.13
  Bottom 0.152: v57,22.88 59.38,25.25 59.38,26.25 64.75,31.62 66.38,31.62 67.12,30.88 76.5,30.88 77.38,31.75 77.75,31.75 IC27.11 | v51.38,22.88 43.75,22.88 v43.12,23.5 | v74.62,11.75 81.12,5.25 91,5.25 92.5,3.75 93.62,3.75 BOTTOMBUS.3
SIGNAL3  (via drill 0.35)
  Top 0.152: 0_3.3 40.88,27.62 38.38,27.62 37.75,28.25 30.88,28.25 30.75,28.38 30.75,29.25 31.5,30 32,30 LOW_OUT.14 32.12,30.12 39.25,30.12 v40.62,31.5 | v76.12,31.62 76.12,31.25 77.62,29.75 77.62,22.38 93.62,6.38 BOTTOMBUS.4 | v51.88,34.5 56.88,39.5 56.88,40.62 57.25,41 58,41 63.25,35.75 63.25,35 65.5,32.75 v66.62,32.75
  Bottom 0.152: v76.12,31.62 76.12,32.75 | 76.12,32.75 76.12,33.5 IC27.12 | v40.62,31.5 42.62,31.5 45.62,34.5 v51.88,34.5 | 76.12,32.75 v66.62,32.75
SIGNAL4  (via drill 0.35)
  Top 0.152: LOW_OUT.15 32.12,31.38 32.5,31.38 33.38,32.25 46.75,32.25 51.62,27.38 53.62,27.38 57.5,23.5 59.88,23.5 4_7.6 60,23.38 61.5,23.38 68.12,16.75 71.62,16.75 v76.25,12.12 | v78.62,34.38 79,34 79.12,34 80.5,32.62 80.5,29.12 80.25,28.88 80.25,23 v92.12,11.12
  Bottom 0.152: v78.62,34.38 76.12,34.38 IC27.13 | BOTTOMBUS.5 96.12,3.75 95.25,4.62 95.25,8 v92.12,11.12 77.25,11.12 v76.25,12.12
SIGNAL5  (via drill 0.35)
  Top 0.152: v58.25,25.38 59.25,25.38 59.88,24.75 4_7.5 60,24.75 v61.62,24.75 | v53,30.62 51,32.62 32.12,32.62 LOW_OUT.16 | v68.38,22 69.62,22 88.88,2.75 91.5,2.75 92.12,3.38 92.12,3.62 93.25,4.75 93.5,4.75 95,6.25 96.12,6.25 BOTTOMBUS.6
  Bottom 0.152: IC27.14 76,35.12 67.75,35.12 59,26.38 59,26.12 v58.25,25.38 v53,30.62 | v68.38,22 66.38,22 63.62,24.75 v61.62,24.75
SIGNAL6  (via drill 0.35)
  Top 0.152: v35.5,33.88 32.12,33.88 LOW_OUT.17 | v51.38,28.88 55.88,28.88 v58.25,26.5 59.38,26.5 59.88,26 4_7.4 60,25.88 61.62,25.88 63.25,24.25 v63.25,24 | v67.75,21.25 69.88,21.25 88.75,2.38 96.25,2.38 97.5,3.62 98.62,3.62 BOTTOMBUS.7
  Bottom 0.152: v58.25,26.5 67.75,36 76,36 IC27.15 | v35.5,33.88 36,33.88 41.88,28 47.5,28 48.38,28.88 v51.38,28.88 | v67.75,21.25 66,21.25 v63.25,24
SIGNAL7  (via drill 0.35)
  Top 0.152: 61.38,28.25 v61.38,30.75 | 61.38,28.25 60.38,27.25 60,27.25 4_7.3 | v44.12,35.25 32.12,35.25 LOW_OUT.18 | v88.62,18.38 86,18.38 v81,23.38 | 61.38,28.25 v62,27.62
  Bottom 0.152: IC27.16 76,36.75 71.12,36.75 70.75,36.38 67.25,36.38 61.62,30.75 v61.38,30.75 58,30.75 53.5,35.25 v44.12,35.25 | v88.62,18.38 98.62,8.38 98.62,6.38 BOTTOMBUS.8 | v81,23.38 66.25,23.38 v62,27.62
SIGNAL8  (via drill 0.35)
  Top 0.152: 8_11.6 41.38,6 32.38,6 32.12,6.25 HIGH_OUT.11 32,6.38 v30.12,6.38 | v65.75,36 65.75,35.75 v75.38,26.12 | v79.5,26.12 79.5,29.25 80.12,29.88 80.12,30.62 79.75,31 79,31 78.38,30.38 78.38,22.62 93.38,7.62 98.75,7.62 100.25,6.12 100.25,4.75 BOTTOMBUS.9 | v2.75,24.25 2.75,25.62 3.88,26.75 4,26.75 5.25,28 5.25,28.12 6.5,29.38 9.62,29.38 22.75,42.5 v54.25,42.5
  Bottom 0.152: v79.5,26.12 v75.38,26.12 | IC27.19 76,39.12 73,39.12 70.62,36.75 66.5,36.75 v65.75,36 64.62,36 64.5,36.12 60.62,36.12 v54.25,42.5 | v30.12,6.38 30.12,7 29.38,7.75 12.25,7.75 4.75,15.25 4.75,15.5 3.62,16.62 3.38,16.62 2.75,17.25 v2.75,24.25
SIGNAL9  (via drill 0.35)
  Top 0.152: 8_11.5 41.38,7.25 40.38,7.25 40.12,7.5 32.12,7.5 HIGH_OUT.12 32,7.5 29.5,7.5 v29,7 | v90.12,31.12 v83.88,37.38 | v36.38,44.25 72.75,44.25 v73,44
  Bottom 0.152: 75,42 75,40.5 75.38,40.12 76,40.12 IC27.20 | 75,42 75.12,42.12 76.88,42.12 81.62,37.38 v83.88,37.38 | v90.12,31.12 90.12,28.25 104.75,13.62 104.75,5.88 104.12,5.25 102.38,5.25 101.38,6.25 BOTTOMBUS.10 | v29,7 10.5,7 2,15.5 2,33 13.25,44.25 v36.38,44.25 | 75,42 v73,44
SIGNAL10  (via drill 0.35)
  Top 0.152: HIGH_OUT.13 32.12,8.75 41.12,8.75 41.38,8.5 8_11.4 41.5,8.5 41.88,8.5 44.38,11 v44.38,13 | v78.75,33.25 78.75,31.25 78,30.5 78,22.5 93.25,7.25 96.62,7.25 97.75,6.12 97.75,5.88 98.88,4.75 99.12,4.75 100.25,3.62 100.25,3.38 100.88,2.75 102.88,2.75 103.75,3.62 BOTTOMBUS.11
  Bottom 0.152: v78.75,33.25 79.38,33.88 79.38,38 76.62,40.75 76.12,40.75 IC27.21 | v44.38,13 48,13 50,11 74.88,11 83.12,2.75 102.88,2.75 103.75,3.62 BOTTOMBUS.11
SIGNAL11  (via drill 0.35)
  Top 0.152: HIGH_OUT.14 32.12,10 32.38,9.75 41.38,9.75 8_11.3 41.5,9.75 41.88,9.75 43.38,11.25 v43.38,13.12 | v89.12,31 v83.88,36.25 | v70.88,13.75 v65,13.75
  Bottom 0.152: v83.88,36.25 82.25,36.25 77,41.5 76.12,41.5 IC27.22 | v89.12,31 89.12,28.75 97.75,20.12 | 97.75,20.12 103.75,14.12 103.75,6.38 BOTTOMBUS.12 | v43.38,13.12 44,13.75 v65,13.75 | v70.88,13.75 71.12,13.75 74.88,17.5 86.62,17.5 88.5,19.38 97,19.38 97.75,20.12
SIGNAL12  (via drill 0.35)
  Top 0.152: 31.25,11 31.5,11.25 32,11.25 HIGH_OUT.15 | 31.25,11 30.75,10.5 30.75,8.38 30.88,8.25 33.12,8.25 33.5,7.88 42.38,7.88 42.75,7.5 42.75,5.5 42.5,5.25 40.25,5.25 40.12,5.12 40.12,4.12 40.25,4 43.5,4 45.38,2.12 60,2.12 61,3.12 61,5.12 60.12,6 59.75,6 12_15.6 | v92.5,33.12 83.62,42 v78.62,42 75.62,45 v42.88,45 | 31.25,11 24.38,17.88 24.38,21 v20.75,24.62 | v18.62,26.75 18.62,36.12 v21.38,38.88
  Bottom 0.152: v78.62,42 77.88,42.75 77.88,43.38 IC27.23 | v92.5,33.12 92.5,31.25 94.12,29.62 94.12,27.75 107.38,14.5 107.38,4.75 106.38,3.75 BOTTOMBUS.13 | v18.62,26.75 v20.75,24.62 | v21.38,38.88 36.75,38.88 v42.88,45
SIGNAL13  (via drill 0.35)
  Top 0.152: v57.25,41.75 53,37.5 v46.88,37.5 | v37,34.5 36,34.5 35.88,34.62 33.25,34.62 33.12,34.5 30.88,34.5 29.62,33.25 29.62,14.62 v30.38,13.88 31.5,12.75 32,12.75 HIGH_OUT.16 | v56.88,7.25 59.62,7.25 12_15.5
  Bottom 0.152: v46.88,37.5 40,37.5 v37,34.5 | IC27.24 78.62,43.5 78.62,44 77.88,44.75 60.25,44.75 v57.25,41.75 55.75,43.25 53.88,43.25 51.62,41 41.5,41 41.12,41.38 41.12,42.12 45.62,46.62 105.62,46.62 106.88,45.38 106.88,24.25 109.88,21.25 109.88,5.88 109.25,5.25 109,5.25 107.88,4.12 107.88,3.88 106.75,2.75 106,2.75 105.38,3.38 105.38,4.12 106.25,5 106.25,6.25 BOTTOMBUS.14 | v56.88,7.25 46.25,7.25 43.12,10.38 33.88,10.38 v30.38,13.88
SIGNAL14  (via drill 0.35)
  Top 0.152: v58,8.62 59.62,8.62 12_15.4 | v38,11.5 34.88,11.5 33.75,12.62 | 33.75,12.62 32.5,13.88 32.12,13.88 HIGH_OUT.17 | v81.25,45.88 103.25,45.88 104.38,44.75 104.38,34.62 v109.38,29.62 | 33.75,12.62 33.12,12 30.88,12 24.75,18.12 24.75,21.75 20.38,26.12 20.38,28.25 19.62,29 19.62,33.25 20.88,34.5 26.62,34.5 33.88,41.75 56.12,41.75 v57.88,43.5
  Bottom 0.152: v58,8.62 56.75,8.62 56.62,8.75 53.88,8.75 53.75,8.62 45.88,8.62 43,11.5 v38,11.5 | 79.5,44.12 79.5,43.5 IC27.25 79.5,44.12 | v81.25,45.88 79.5,44.12 | v109.38,29.62 109.38,22.25 110.25,21.38 110.25,5 109,3.75 BOTTOMBUS.15 | v57.88,43.5 58.5,43.5 60.12,45.12 78.5,45.12 79.5,44.12
SIGNAL15  (via drill 0.35)
  Top 0.152: v36.12,12.25 33.25,15.12 32.12,15.12 HIGH_OUT.18 | v56.25,8 58,9.75 59.62,9.75 12_15.3 59.75,9.88 64.12,9.88 64.75,10.5 69,10.5 v71.62,13.12 | v80.25,39.88 80.25,38.75 91.5,27.5 v95.5,27.5 | v89.38,15.12 94,10.5 104.75,10.5 108.88,6.38 BOTTOMBUS.16
  Bottom 0.152: v36.12,12.25 37.62,10.75 43.25,10.75 46,8 v56.25,8 | v80.25,39.88 80.25,43.38 IC27.26 | v95.5,27.5 95.5,26.88 108.88,13.5 108.88,6.38 BOTTOMBUS.16 | v71.62,13.12 73.25,13.12 75.25,15.12 v89.38,15.12
VCC  (via drill 0.35)
  Top 0.457: v39.25,14.62 36.25,17.62 32.12,17.62 HIGH_OUT.20 | v46.25,14.62 46.25,13.5 47.5,12.25 8_11.16 | 12_15.16 62.88,12.38 v60.75,14.5 | v52.38,16.75 50.5,18.62 50.5,27.62 48.12,30 47.12,30 0_3.16 47,30.25 v46,31.25 | 44.25,37.62 45.5,37.62 49.62,33.5 57.62,33.5 | 44.25,37.62 32.12,37.62 LOW_OUT.20 | 57.62,33.5 61,33.5 64.62,29.88 66,29.88 4_7.16 | 57.62,33.5 v57.62,40.25 | C1.1 163,40.62 173.75,40.62 176.12,43 J2.5 | v80.12,34.12 v78.62,35.62 | v96.12,20.62 v153.75,20.62 | v82.75,34.88 75.75,41.88 62.88,41.88 61.62,43.12 60.62,43.12 SV5.5 | v46,33.75 46,34.62 44.25,36.38 44.25,37.62
  Bottom 0.457: v39.25,14.62 v46.25,14.62 46.38,14.5 52.38,14.5 | 52.38,14.5 v60.75,14.5 | 52.38,14.5 v52.38,16.75 | v57.62,40.25 60.5,43.12 SV5.5 | 82.5,34.12 82.5,34.38 82.88,34.75 | 82.5,34.12 82.5,33.62 82.62,33.5 82.62,31.88 IC27.5 | 82.88,34.75 83.5,35.38 84.25,35.38 | 84.25,35.38 84.75,35.88 84.75,38 85,38.25 | 85,38.25 85.25,38.5 87.62,38.5 IC27.38 | v78.62,35.62 78.62,35.88 77,37.5 76.12,37.5 IC27.17 | 82.5,34.12 v80.12,34.12 | 85,38.25 81.12,42.12 81.12,43.38 IC27.27 | v153.75,20.62 176.12,43 J2.5 | v96.12,20.62 96.12,21 86.5,30.62 86.5,33.12 84.25,35.38 | v82.75,34.88 82.88,34.75 | v46,33.75 v46,31.25

### Text on the board
bPlace: P1001-001-004-320 A Register | Copyright 2020 James Wright